# Altium schematic sheet Programming_main.SchDoc
size A4 portrait
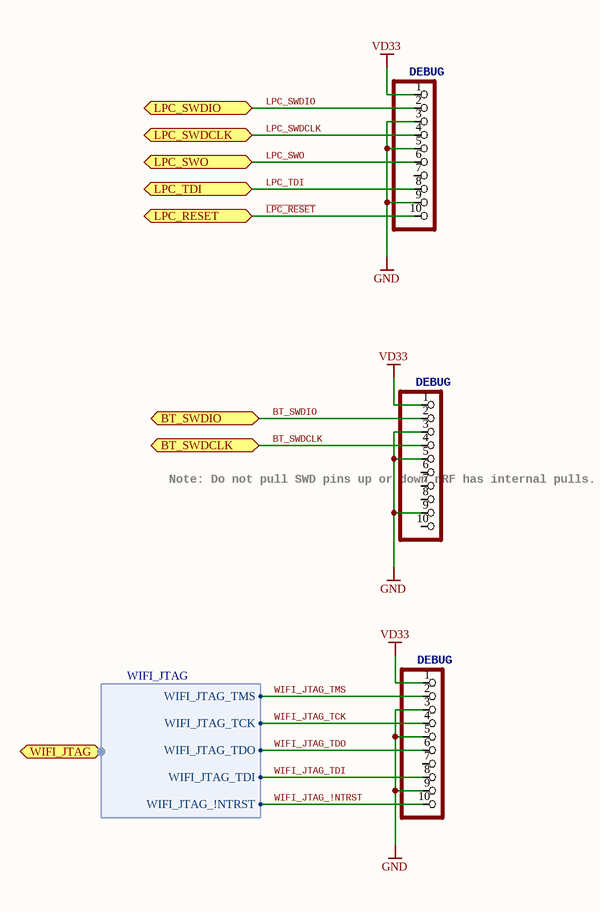
[diagram p0: Programming_main.SchDoc]

## Parts
LPC_DEBUG  DEBUG  [2X05_SMT]  (no BOM)
NRF_DEBUG  DEBUG  [2X05_SMT]  (no BOM)
WIFI_DEBUG  DEBUG  [2X05_SMT]  (no BOM)

## Ports
BT_SWDCLK, BT_SWDIO, LPC_RESET, LPC_SWDCLK, LPC_SWDIO, LPC_SWO, LPC_TDI, WIFI_JTAG (harness WIFI_JTAG)

## Harnesses
WIFI_JTAG: WIFI_JTAG_TCK, WIFI_JTAG_TDO, WIFI_JTAG_TDI, WIFI_JTAG_TMS, WIFI_JTAG_!NTRST

## Nets
GND: LPC_DEBUG.3 LPC_DEBUG.5 LPC_DEBUG.9 NRF_DEBUG.3 NRF_DEBUG.5 NRF_DEBUG.9 WIFI_DEBUG.3 WIFI_DEBUG.5 WIFI_DEBUG.9
VD33: LPC_DEBUG.1 NRF_DEBUG.1 WIFI_DEBUG.1
BT_SWDCLK: NRF_DEBUG.4 ; port BT_SWDCLK
BT_SWDIO: NRF_DEBUG.2 ; port BT_SWDIO
~{LPC_RESET}: LPC_DEBUG.10 ; port LPC_RESET
LPC_SWDCLK: LPC_DEBUG.4 ; port LPC_SWDCLK
LPC_SWDIO: LPC_DEBUG.2 ; port LPC_SWDIO
LPC_SWO: LPC_DEBUG.6 ; port LPC_SWO
LPC_TDI: LPC_DEBUG.8 ; port LPC_TDI
WIFI_JTAG_!NTRST: WIFI_DEBUG.10 ; port WIFI_JTAG.WIFI_JTAG_!NTRST
WIFI_JTAG_TCK: WIFI_DEBUG.4 ; port WIFI_JTAG.WIFI_JTAG_TCK
WIFI_JTAG_TDI: WIFI_DEBUG.8 ; port WIFI_JTAG.WIFI_JTAG_TDI
WIFI_JTAG_TDO: WIFI_DEBUG.6 ; port WIFI_JTAG.WIFI_JTAG_TDO
WIFI_JTAG_TMS: WIFI_DEBUG.2 ; port WIFI_JTAG.WIFI_JTAG_TMS

Not connected (* = marked no-connect by the designer): LPC_DEBUG 7; NRF_DEBUG 6 7 8 10; WIFI_DEBUG 7

## Notes on the sheet
- (near NRF_DEBUG) Note:
  Do not pull SWD pins up or down
  nRF has internal pulls.

## Library data of the parts
LPC_DEBUG NRF_DEBUG WIFI_DEBUG = HEADER-2X5SMD-1.27MM: cortex DEBUG connector